# Altium schematic sheet WaveGen.SchDoc
size A4
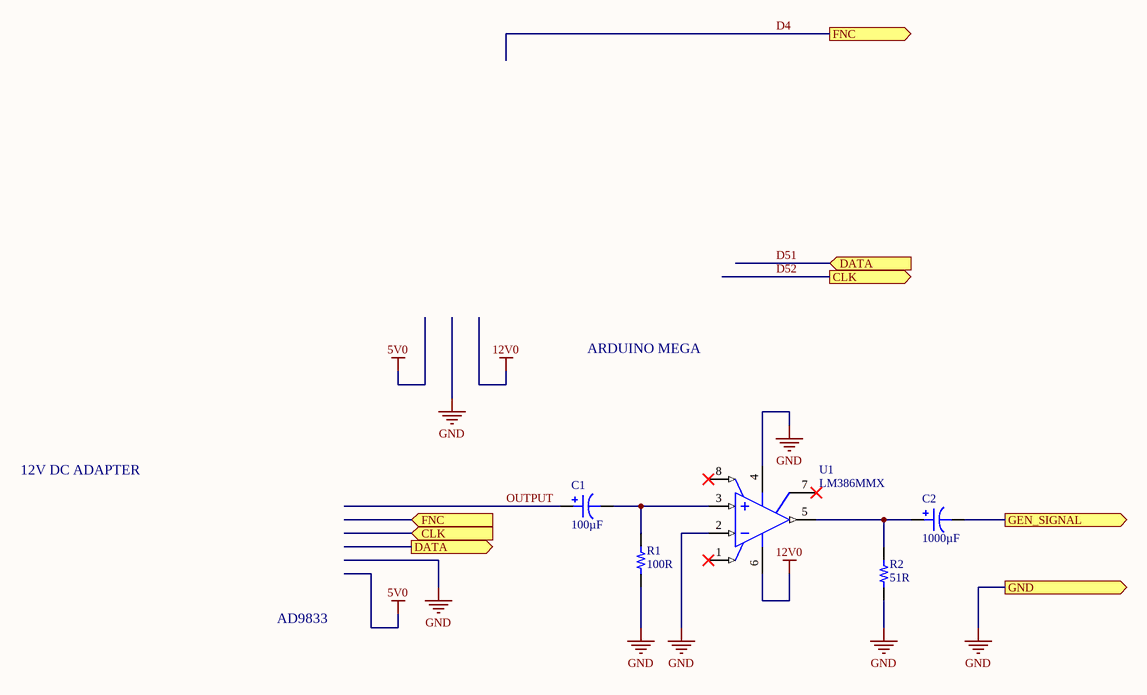
[diagram p0: WaveGen.SchDoc]

## Parts
C1  100µF  [CAP TH ALUM ELEC D8.00mm S3.50mm H12.50mm]
C2  1000µF  [CAP TH ALUM ELEC D8.00mm S3.50mm H12.50mm]
R1  100R  [RES 0805_2012]
R2  51R  [RES 0805_2012]
U1  LM386MMX  [TI-DGK8_N]

## Ports
CLK (in), CLK (out), DATA (in), DATA (out), FNC (in), FNC (out), GEN_SIGNAL (out), GND (out)

## Nets
12V0: U1.6(VS)
GND: R1.1 R2.1 U1.2(IN-) U1.4(GND) ; port GND
D4: port FNC
D51: port DATA
D52: port CLK
GEN_SIGNAL: C2.2 ; port GEN_SIGNAL
OUTPUT: C1.1
NetC1_2: C1.2 R1.2 U1.3(IN+)
NetC2_1: C2.1 R2.2 U1.5(VOUT)

Not connected (* = marked no-connect by the designer): U1 1(GAIN)* 7(BYPASS)* 8(GAIN)*

## Notes on the sheet
- ARDUINO MEGA
- 12V DC ADAPTER
- AD9833

## Library data of the parts
C1 C2 = UKL1C151MPD1TD: CAP ALUM 150UF 20% 16V RADIAL; Manufacturer: Nichicon; Capacitance: 150µF; Lifetime @ Temp.: 2000 Hrs @ 85°C; Polarization: Polar; Ripple Current @ High Frequency: 420mA @ 10kHz; Ripple Current @ Low Frequency: 280mA @ 120Hz; Part Number: UKL1C151MPD1TD; Applications: General Purpose; ComponentLink1Description: Datasheet; ComponentLink1URL: http://nichicon-us.com/english/products/pdfs/e-ukl.pdf; ComponentLink2Description: DigiKey Link; ComponentLink2URL: http://digikey.com/product-detail/en/nichicon/UKL1C151MPD1TD/493-10480-1-ND/4318094; Device Package: Radial, Can; Height - Seated (Max): 0.492" (12.50mm); LastUpdated: 7/09/2020 05:24:52; Lead Spacing: 0.138" (3.50mm); Lifecycle Status: Active; Minimum Order: 1; Mounting Type: Through Hole; Operating Temperature: -40°C ~ 85°C; Package / Case: Radial, Can; Packaging: TapeAndBox; PartId: 7189; Part Status: Active; Price: 0.13; Series: UKL; Size / Dimension: 0.315" Dia (8.00mm); Supplier 1: DigiKey; Supplier Part Number 1: 493-10480-1-ND; Tolerance: ±20%; Voltage - Rated: 16V
  C1: Value: 100µF
  C2: Value: 1000µF
R1 R2 = RG2012P-275-B-T5: RES 2.7M OHM 0.1% 1/8W 0805; Manufacturer: Susumu; Power (Watts): 0.125W, 1/8W; Resistance: 2.7 MOhms; Temperature Coefficient: ±25ppm/°C; Part Number: RG2012P-275-B-T5; ComponentLink1Description: Datasheet; ComponentLink1URL: http://www.susumu.co.jp/common/pdf/n_catalog_partition01_en.pdf; ComponentLink2Description: DigiKey Link; ComponentLink2URL: http://digikey.com/product-detail/en/susumu/RG2012P-275-B-T5/408-2028-1-ND/7035411; Composition: Thin Film; Device Package: 0805 (2012 Metric); Features: Anti-Sulfur, Automotive AEC-Q200; Height - Seated (Max): 0.020" (0.50mm); LastUpdated: 2/09/2020 01:15:24; Lifecycle Status: Active; Minimum Order: 1; Number of Terminations: 2; Operating Temperature: -55°C ~ 155°C; Package / Case: 0805 (2012 Metric); Packaging: TapeAndReel; PartId: 27687; Part Status: Active; Price: 0.08; Ratings: AEC-Q200; Series: RG; Size / Dimension: 0.079" L x 0.049" W (2.00mm x 1.25mm); Supplier 1: DigiKey; Supplier Part Number 1: 408-2028-1-ND; Supplier Device Package: 0805; Tolerance: ±0.1%
  R1: Value: 100R
  R2: Value: 51R
U1 = CMP-0994-00049-1: Low Voltage Audio Power Amplifier, 0 to 70 degC, 8-pin SOP (DGK8), Green (RoHS & no Sb/Br); PartNumber: LM386MMX-1/NOPB; Manufacturer: Texas Instruments; SubFamily: Mid/High-Power Amplifier; Input Type: Analog; Max. Number of Speaker Outputs: 1; PackageReference: DGK8; Eco-Plan: Green (RoHS & no Sb/Br); Code_JEDEC: MO-187; Mounting Technology: Surface Mount; ComponentLink3URL: http://www.ti.com/litv/pdf/mpds028d; ComponentLink1Description: Manufacturer URL; ComponentLink2URL: http://www.ti.com/general/docs/lit/getliterature.tsp?genericPartNumber=LM386&fileType=pdf; PackageDescription: 8-Pin Thin Small Outline, Body 3 x 3 mm, Pitch 0.65 mm; ComponentLink1URL: http://www.ti.com/; ComponentLink3Description: Package Specification; DatasheetVersion: SNAS545A; PackageVersion: 4073329/E, 05/2006; ComponentLink2Description: Datasheet